# Altium schematic sheet supply.SchDoc
size B
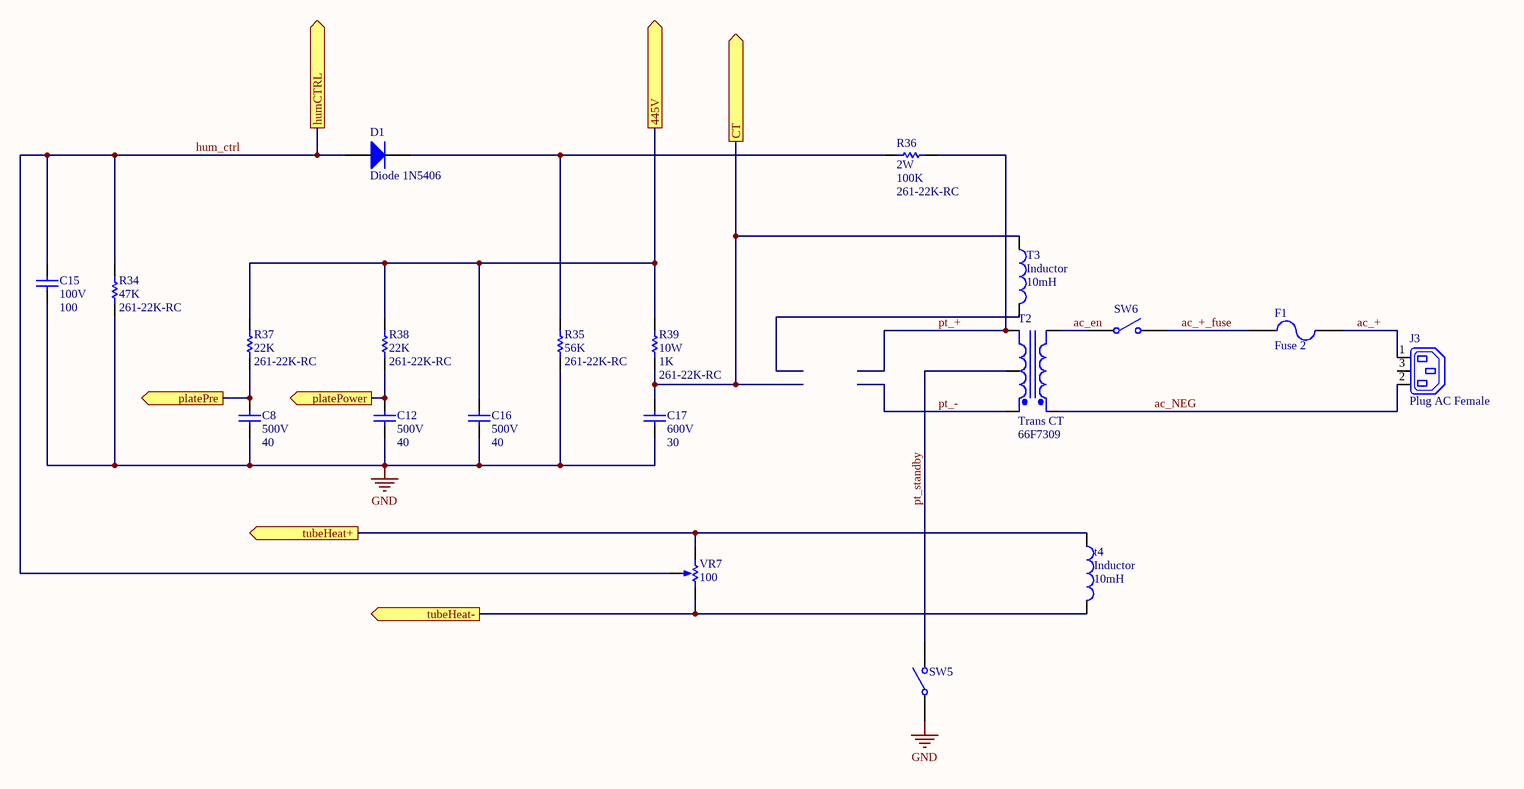
[diagram p0: supply.SchDoc]

## Parts
C8  500V  value 40  [RAD-0.3]
C12  500V  value 40  [RAD-0.3]
C15  100V  value 100  [RAD-0.3]
C16  500V  value 40  [RAD-0.3]
C17  600V  value 30  [RAD-0.3]
D1  Diode 1N5406  [DO-201AD]
F1  Fuse 2  [PIN-W2/E2.8]
J3  Plug AC Female  [IEC7-2H3]
R34  value 47K  Supplier Part Number 1: 261-22K-RC  [AXIAL-0.3]  (hidden comment: Res1)
R35  value 56K  Supplier Part Number 1: 261-22K-RC  [AXIAL-0.3]  (hidden comment: Res1)
R36  2W  value 100K  Supplier Part Number 1: 261-22K-RC  [AXIAL-0.3]
R37  value 22K  Supplier Part Number 1: 261-22K-RC  [AXIAL-0.3]  (hidden comment: Res1)
R38  value 22K  Supplier Part Number 1: 261-22K-RC  [AXIAL-0.3]  (hidden comment: Res1)
R39  10W  value 1K  Supplier Part Number 1: 261-22K-RC  [AXIAL-0.3]
SW5  SW-SPST  [SPST-2]  (value not drawn)
SW6  SW-SPST  [SPST-2]  (value not drawn)
T2  Trans CT  Supplier Part Number 1: 66F7309  [HDR1X5]
T3  Inductor  value 10mH  [HDR1X2]
t4  Inductor  value 10mH  [HDR1X2]
VR7  value 100  [VR5]  (hidden comment: RPot)

## Ports
445V (out), CT (out), humCTRL (out), platePower (out), platePre (out), tubeHeat+ (out), tubeHeat- (out)

## Nets
GND: C8.1 C12.1 C15.1 C16.1 C17.1 R34.1 R35.1 SW5.1(COMMON)
445V: C16.2 R37.2 R38.2 R39.2 ; port 445V
ac_+: F1.2 J3.1(L)
ac_+_fuse: F1.1 SW6.2(NO)
ac_en: SW6.1(COMMON) T2.2(Pri-)
ac_NEG: J3.2(N) T2.1(Pri+)
CT: C17.2 R39.1 T3.1 ; port CT
hum_ctrl: C15.2 D1.1(A) R34.2 VR7.3(TAP) ; port humCTRL
platePower: C12.2 R38.1 ; port platePower
platePre: C8.2 R37.1 ; port platePre
pt_+: R36.1 T2.5(Sec-)
pt_-: T2.3(Sec+)
pt_standby: SW5.2(NO) T2.4(SecCT)
tubeHeat+: t4.1 VR7.1(TOP) ; port tubeHeat+
tubeHeat-: t4.2 VR7.2(BOT) ; port tubeHeat-
NetD1_2: D1.2(K) R35.2 R36.2

Not connected (* = marked no-connect by the designer): J3 3(E); T3 2

## Library data of the parts
C8 C12 C15-C17 = Cap: Capacitor; Published: 8-Jun-2000; LatestRevisionDate: 17-Jul-2002; LatestRevisionNote: Re-released for DXP Platform.; PackageReference: RAD-0.3; Publisher: Altium Limited; PackageDescription: Radial Cap, Thru-Hole; 2 Leads; 0.3 in Pin Spacing
D1 = Diode 1N5406: 3 Amp General Purpose Rectifier; Published: 8-Jun-2000; LatestRevisionDate: 17-Jul-2002; LatestRevisionNote: Re-released for DXP Platform.; DatasheetVersion: 1998; PackageVersion: Aug-1999; PackageReference: DO-201AD; Publisher: Altium Limited; PackageDescription: Diode, Axial; Body 9.5 x 5.6 mm (LxDia. max), Lead Dia. 1.32 mm (max); ComponentLink1Description: Manufacturer Link; ComponentLink1URL: http://www.fairchildsemi.com/; ComponentLink2Description: Datasheet; ComponentLink2URL: http://www.fairchildsemi.com/ds/1N%2F1N5400.pdf
F1 = Fuse 2: Fuse; Published: 8-Jun-2000; LatestRevisionDate: 17-Jul-2002; LatestRevisionNote: Re-released for DXP Platform.; PackageReference: PIN-W2/E2.8; Publisher: Altium Limited; PackageDescription: Thru-Hole; 2 Leads
J3 = Plug AC Female: IEC Mains Power Outlet, EN60 320-2-2 F Class I, PC Flange Rear Mount, Chassis Socket; PackageDocument: ver.80, 15-Sep-2003; MaximumRating: 10A, 250V a.c. (UL & CSA 15A, 250V a.c.); MountingFixtures: Not drawn on schematic symbol.; PCB_Layout: Complies with manufacturer's recommendation.; DrillSize: Corresponds to nominal value.; Published: 15-Jul-2004; LatestRevisionDate: 15-Jul-2004; LatestRevisionNote: Component Replaced & renamed from "Phonejack".; DatasheetDocument: ver.80, 15-Sep-2003; PackageReference: PX0675/PC; Publisher: Altium Limited; Terminations: P.C. Spills; ComponentLink1Description: Manufacturer Link; ComponentLink1URL: http://www.bulgin.co.uk/
R34-R39 = Res1: Resistor; Published: 8-Jun-2000; LatestRevisionDate: 17-Jul-2002; LatestRevisionNote: Re-released for DXP Platform.; PackageReference: AXIAL-0.3; Publisher: Altium Limited; PackageDescription: Axial Device, Thru-Hole; 2 Leads; 0.3 in Pin Spacing; Supplier 1: Mouser
SW5 SW6 = SW-SPST: Single-Pole, Single-Throw Switch; Published: 24-Mar-1999; LatestRevisionDate: 17-Jul-2002; LatestRevisionNote: Re-released for DXP Platform.; PackageReference: SPST-2; Publisher: Altium Limited; PackageDescription: Switch; 2 Leads
T2 = Trans CT: Center-Tapped Transformer (Coupled Inductor Model); Published: 8-Jun-2000; LatestRevisionDate: 17-Jul-2002; LatestRevisionNote: Re-released for DXP Platform.; PackageReference: TRF_5; Publisher: Altium Limited; PackageDescription: Transformer; 5 Leads; Supplier 1: Newark
T3 t4 = Inductor: Code_IEC: 1005; Published: 8-Jun-2000; LatestRevisionDate: 29-May-2009; LatestRevisionNote: IPC-7351 Footprint Added.; PackageReference: 0402-A; Publisher: Altium Limited; PackageDescription: Chip Inductor; Code_JEITA: 0402
VR7 = RPot: Potentiometer; Sim Note: Enter the Resistance value and the set point into parameter fields.; Set Position: 0.5; Published: 8-Jun-2000; LatestRevisionDate: 17-Jul-2002; LatestRevisionNote: Re-released for DXP Platform.; PackageReference: VR5; Publisher: Altium Limited; PackageDescription: Variable Resistor, Thru-Hole; 3 Leads